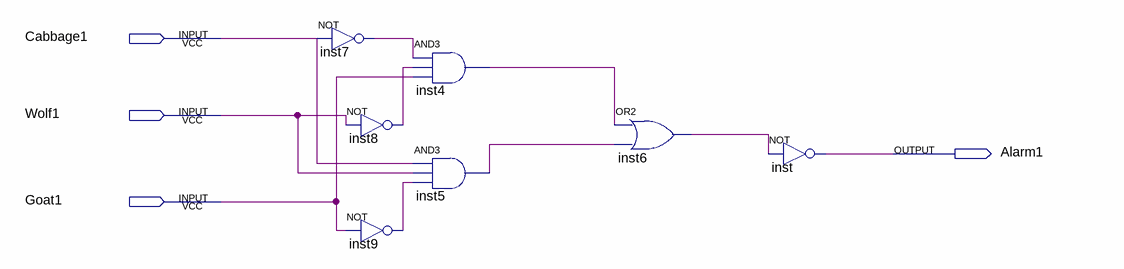
[diagram p0: schematic sheet]
// Quartus schematic lab2step2_try2.bdf as structural Verilog: 7 symbols, 4 pins
module lab2step2_try2 (
  input  Cabbage1,
  input  Wolf1,
  input  Goat1,
  output Alarm1
);

  wire inst4_out, inst5_out, inst6_out, inst7_out, inst8_out, inst9_out;

  not inst7 (inst7_out, Cabbage1);
  not inst8 (inst8_out, Wolf1);
  not inst9 (inst9_out, Goat1);
  and inst4 (inst4_out, inst7_out, inst8_out, Goat1);
  and inst5 (inst5_out, Cabbage1, Wolf1, inst9_out);
  or inst6 (inst6_out, inst4_out, inst5_out);
  not inst (Alarm1, inst6_out);
endmodule
